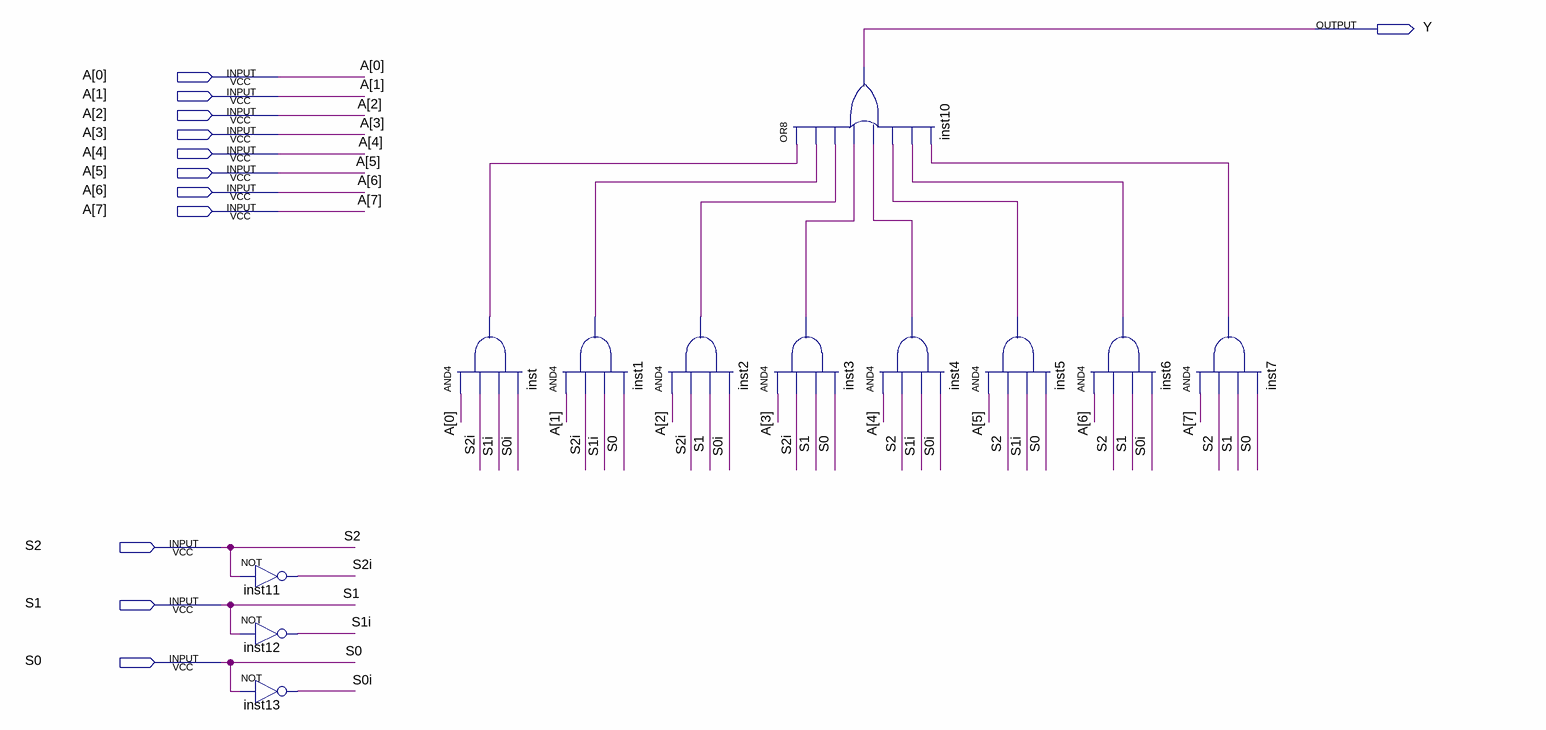
[diagram p0: schematic sheet]
// Quartus schematic mux8to1.bdf as structural Verilog: 12 symbols, 12 pins
module mux8to1 (
  input  [7:0] A,
  input  S2,
  input  S1,
  input  S0,
  output Y
);

  wire inst1_out, inst2_out, inst3_out, inst4_out, inst5_out, inst6_out, inst7_out, inst_out, S0i, S1i, S2i;

  not inst11 (S2i, S2);
  not inst12 (S1i, S1);
  not inst13 (S0i, S0);
  and inst (inst_out, A[0], S2i, S1i, S0i);
  and inst1 (inst1_out, A[1], S2i, S1i, S0);
  and inst2 (inst2_out, A[2], S2i, S1, S0i);
  or inst10 (Y, inst_out, inst1_out, inst2_out, inst3_out, inst4_out, inst5_out, inst6_out, inst7_out);
  and inst3 (inst3_out, A[3], S2i, S1, S0);
  and inst4 (inst4_out, A[4], S2, S1i, S0i);
  and inst5 (inst5_out, A[5], S2, S1i, S0);
  and inst6 (inst6_out, A[6], S2, S1, S0i);
  and inst7 (inst7_out, A[7], S2, S1, S0);
endmodule
